# Altium schematic sheet Modules.SchDoc: Modules
size B; DocumentNumber: 13; SheetNumber: 13; SheetTotal: 22
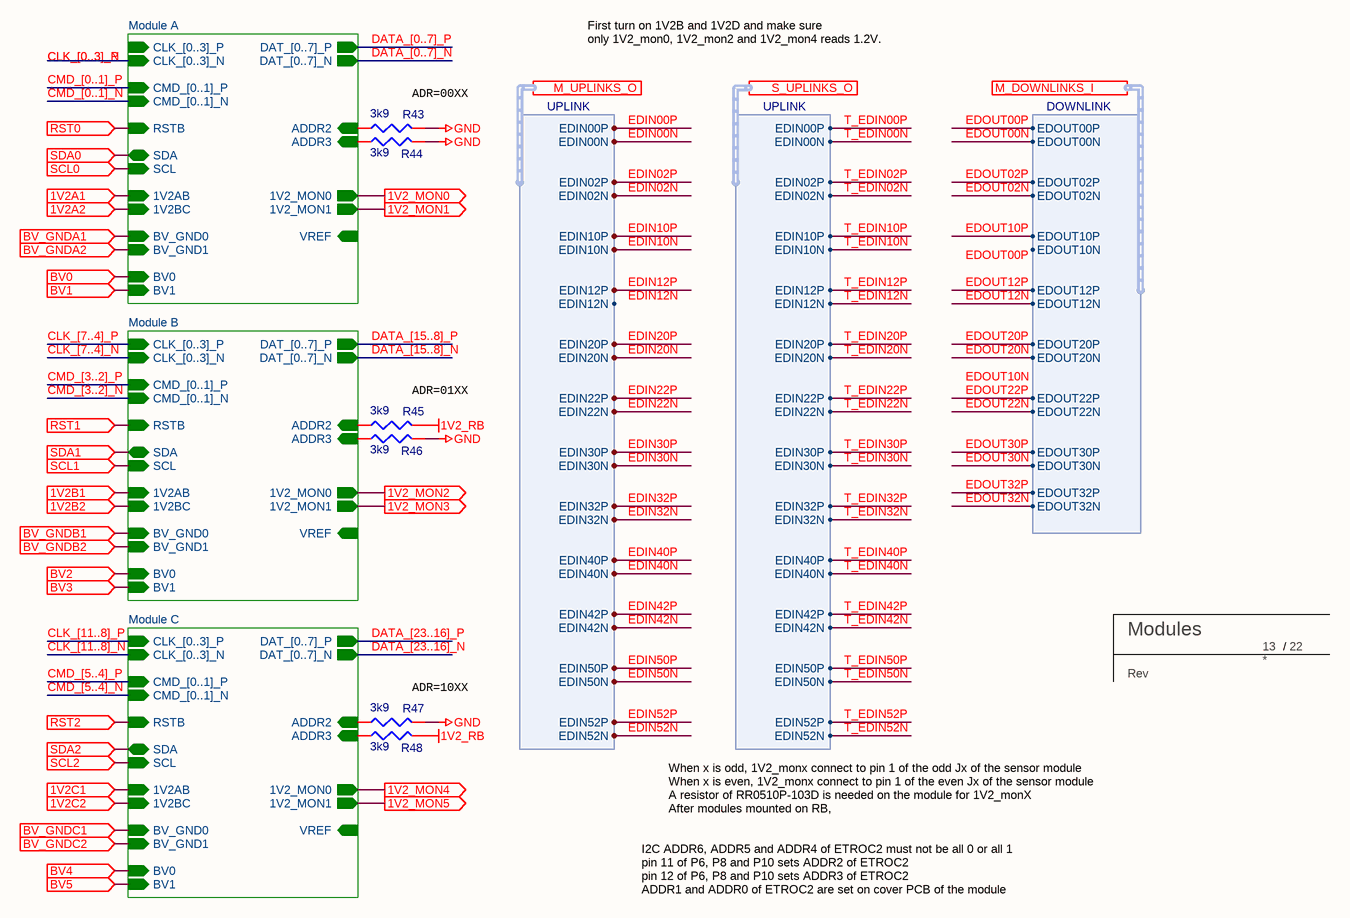
[diagram p0: Modules.SchDoc]

## Parts
R43  3k9  [R_0402_IPC]
R44  3k9  [R_0402_IPC]
R45  3k9  [R_0402_IPC]
R46  3k9  [R_0402_IPC]
R47  3k9  [R_0402_IPC]
R48  3k9  [R_0402_IPC]
TBLOCK?  BU Title block  (value not drawn)  (graphical)

## Sub-sheets
Module A = Module.SchDoc: BV_GND0 (in), VREF (in), 1V2BC (in), 1V2_MON1 (out), 1V2_MON0 (out), RSTB (in), 1V2AB (in), SDA (bidir), SCL (in), DAT_[0..7]_N (out), DAT_[0..7]_P (out), CMD_[0..1]_N (in), CMD_[0..1]_P (in), CLK_[0..3]_N (in), CLK_[0..3]_P (in), BV0 (in), BV1 (in), ADDR3 (in), ADDR2 (in), BV_GND1 (in)
Module B = Module.SchDoc: BV_GND0 (in), VREF (in), 1V2BC (in), 1V2_MON1 (out), 1V2_MON0 (out), RSTB (in), 1V2AB (in), SDA (bidir), SCL (in), DAT_[0..7]_N (out), DAT_[0..7]_P (out), CMD_[0..1]_N (in), CMD_[0..1]_P (in), CLK_[0..3]_N (in), CLK_[0..3]_P (in), BV0 (in), BV1 (in), ADDR3 (in), ADDR2 (in), BV_GND1 (in)
Module C = Module.SchDoc: BV_GND0 (in), VREF (in), 1V2BC (in), 1V2_MON1 (out), 1V2_MON0 (out), RSTB (in), 1V2AB (in), SDA (bidir), SCL (in), DAT_[0..7]_N (out), DAT_[0..7]_P (out), CMD_[0..1]_N (in), CMD_[0..1]_P (in), CLK_[0..3]_N (in), CLK_[0..3]_P (in), BV0 (in), BV1 (in), ADDR2 (in), ADDR3 (in), BV_GND1 (in)

## Ports
1V2_MON0 (out), 1V2_MON1 (out), 1V2_MON2 (out), 1V2_MON3 (out), 1V2_MON4 (out), 1V2_MON5 (out), 1V2A1 (in), 1V2A2 (in), 1V2B1 (in), 1V2B2 (in), 1V2C1 (in), 1V2C2 (in), BV0 (in), BV1 (in), BV2 (in), BV3 (in), BV4 (in), BV5 (in), BV_GNDA1 (in), BV_GNDA2 (in), BV_GNDB1 (in), BV_GNDB2 (in), BV_GNDC1 (in), BV_GNDC2 (in), M_DOWNLINKS_I (harness DOWNLINK), M_UPLINKS_O (harness UPLINK), RST0 (in), RST1 (in), RST2 (in), S_UPLINKS_O (harness UPLINK), SCL0 (in), SCL1 (in), SCL2 (in), SDA0 (in), SDA1 (in), SDA2 (in)

## Harnesses
UPLINK: EDIN00P, EDIN00N, EDIN02P, EDIN02N, EDIN10P, EDIN10N, EDIN12P, EDIN12N, EDIN20P, EDIN20N, EDIN22P, EDIN22N, EDIN30P, EDIN30N, EDIN32P, EDIN32N, EDIN40P, EDIN42P, EDIN50P, EDIN52P, EDIN52N, EDIN50N, EDIN42N, EDIN40N
DOWNLINK: EDOUT30N, EDOUT30P, EDOUT22N, EDOUT22P, EDOUT20N, EDOUT20P, EDOUT12N, EDOUT10N, EDOUT02N, EDOUT00N, EDOUT00P, EDOUT02P, EDOUT10P, EDOUT12P, EDOUT32N, EDOUT32P

## Nets
1V2_RB: R45.2 R48.2
GND: R43.2 R44.2 R46.2 R47.2
1V2_MON0: port 1V2_MON0, sheet Module A/1V2_MON0
1V2_MON1: port 1V2_MON1, sheet Module A/1V2_MON1
1V2_MON2: port 1V2_MON2, sheet Module B/1V2_MON0
1V2_MON3: port 1V2_MON3, sheet Module B/1V2_MON1
1V2_MON4: port 1V2_MON4, sheet Module C/1V2_MON0
1V2_MON5: port 1V2_MON5, sheet Module C/1V2_MON1
1V2A1: port 1V2A1, sheet Module A/1V2AB
1V2A2: port 1V2A2, sheet Module A/1V2BC
1V2B1: port 1V2B1, sheet Module B/1V2AB
1V2B2: port 1V2B2, sheet Module B/1V2BC
1V2C1: port 1V2C1, sheet Module C/1V2AB
1V2C2: port 1V2C2, sheet Module C/1V2BC
BV0: port BV0, sheet Module A/BV0
BV1: port BV1, sheet Module A/BV1
BV2: port BV2, sheet Module B/BV0
BV3: port BV3, sheet Module B/BV1
BV4: port BV4, sheet Module C/BV0
BV5: port BV5, sheet Module C/BV1
BV_GNDA1: port BV_GNDA1, sheet Module A/BV_GND0
BV_GNDA2: port BV_GNDA2, sheet Module A/BV_GND1
BV_GNDB1: port BV_GNDB1, sheet Module B/BV_GND0
BV_GNDB2: port BV_GNDB2, sheet Module B/BV_GND1
BV_GNDC1: port BV_GNDC1, sheet Module C/BV_GND0
BV_GNDC2: port BV_GNDC2, sheet Module C/BV_GND1
EDIN00N: port M_UPLINKS_O.EDIN00N
EDIN00P: port M_UPLINKS_O.EDIN00P
EDIN02N: port M_UPLINKS_O.EDIN02N
EDIN02P: port M_UPLINKS_O.EDIN02P
EDIN10N: port M_UPLINKS_O.EDIN10N
EDIN10P: port M_UPLINKS_O.EDIN10P
EDIN12P: port M_UPLINKS_O.EDIN12P
EDIN20N: port M_UPLINKS_O.EDIN20N
EDIN20P: port M_UPLINKS_O.EDIN20P
EDIN22N: port M_UPLINKS_O.EDIN22N
EDIN22P: port M_UPLINKS_O.EDIN22P
EDIN30N: port M_UPLINKS_O.EDIN30N
EDIN30P: port M_UPLINKS_O.EDIN30P
EDIN32N: port M_UPLINKS_O.EDIN32N
EDIN32P: port M_UPLINKS_O.EDIN32P
EDIN40N: port M_UPLINKS_O.EDIN40N
EDIN40P: port M_UPLINKS_O.EDIN40P
EDIN42N: port M_UPLINKS_O.EDIN42N
EDIN42P: port M_UPLINKS_O.EDIN42P
EDIN50N: port M_UPLINKS_O.EDIN50N
EDIN50P: port M_UPLINKS_O.EDIN50P
EDIN52N: port M_UPLINKS_O.EDIN52N
EDIN52P: port M_UPLINKS_O.EDIN52P
EDOUT00N: port M_DOWNLINKS_I.EDOUT00N
EDOUT00P: port M_DOWNLINKS_I.EDOUT00P
EDOUT02N: port M_DOWNLINKS_I.EDOUT02N
EDOUT02P: port M_DOWNLINKS_I.EDOUT02P
EDOUT10P: port M_DOWNLINKS_I.EDOUT10P
EDOUT12N: port M_DOWNLINKS_I.EDOUT12N
EDOUT12P: port M_DOWNLINKS_I.EDOUT12P
EDOUT20N: port M_DOWNLINKS_I.EDOUT20N
EDOUT20P: port M_DOWNLINKS_I.EDOUT20P
EDOUT22N: port M_DOWNLINKS_I.EDOUT22N
EDOUT22P: port M_DOWNLINKS_I.EDOUT22P
EDOUT30N: port M_DOWNLINKS_I.EDOUT30N
EDOUT30P: port M_DOWNLINKS_I.EDOUT30P
EDOUT32N: port M_DOWNLINKS_I.EDOUT32N
EDOUT32P: port M_DOWNLINKS_I.EDOUT32P
RST0: port RST0, sheet Module A/RSTB
RST1: port RST1, sheet Module B/RSTB
RST2: port RST2, sheet Module C/RSTB
SCL0: port SCL0, sheet Module A/SCL
SCL1: port SCL1, sheet Module B/SCL
SCL2: port SCL2, sheet Module C/SCL
SDA0: port SDA0, sheet Module A/SDA
SDA1: port SDA1, sheet Module B/SDA
SDA2: port SDA2, sheet Module C/SDA
T_EDIN00N: port S_UPLINKS_O.EDIN00N
T_EDIN00P: port S_UPLINKS_O.EDIN00P
T_EDIN02N: port S_UPLINKS_O.EDIN02N
T_EDIN02P: port S_UPLINKS_O.EDIN02P
T_EDIN10N: port S_UPLINKS_O.EDIN10N
T_EDIN10P: port S_UPLINKS_O.EDIN10P
T_EDIN12N: port S_UPLINKS_O.EDIN12N
T_EDIN12P: port S_UPLINKS_O.EDIN12P
T_EDIN20N: port S_UPLINKS_O.EDIN20N
T_EDIN20P: port S_UPLINKS_O.EDIN20P
T_EDIN22N: port S_UPLINKS_O.EDIN22N
T_EDIN22P: port S_UPLINKS_O.EDIN22P
T_EDIN30N: port S_UPLINKS_O.EDIN30N
T_EDIN30P: port S_UPLINKS_O.EDIN30P
T_EDIN32N: port S_UPLINKS_O.EDIN32N
T_EDIN32P: port S_UPLINKS_O.EDIN32P
T_EDIN40N: port S_UPLINKS_O.EDIN40N
T_EDIN40P: port S_UPLINKS_O.EDIN40P
T_EDIN42N: port S_UPLINKS_O.EDIN42N
T_EDIN42P: port S_UPLINKS_O.EDIN42P
T_EDIN50N: port S_UPLINKS_O.EDIN50N
T_EDIN50P: port S_UPLINKS_O.EDIN50P
T_EDIN52N: port S_UPLINKS_O.EDIN52N
T_EDIN52P: port S_UPLINKS_O.EDIN52P
NetR43_1: R43.1 ; sheet Module A/ADDR2
NetR44_1: R44.1 ; sheet Module A/ADDR3
NetR45_1: R45.1 ; sheet Module B/ADDR2
NetR46_1: R46.1 ; sheet Module B/ADDR3
NetR47_1: R47.1 ; sheet Module C/ADDR2
NetR48_1: R48.1 ; sheet Module C/ADDR3

## Buses and harness runs
bus CLK_[0..3]_N = CLK_[0..3]_P
bus CLK_[7..4]_N = sheet Module B/CLK_[0..3]_N
bus CLK_[7..4]_P = sheet Module B/CLK_[0..3]_P
bus CLK_[11..8]_N = sheet Module C/CLK_[0..3]_N
bus CLK_[11..8]_P = sheet Module C/CLK_[0..3]_P
bus CMD_[0..1]_N = sheet Module A/CMD_[0..1]_N
bus CMD_[0..1]_P = sheet Module A/CMD_[0..1]_P
bus CMD_[3..2]_N = sheet Module B/CMD_[0..1]_N
bus CMD_[3..2]_P = sheet Module B/CMD_[0..1]_P
bus CMD_[5..4]_N = sheet Module C/CMD_[0..1]_N
bus CMD_[5..4]_P = sheet Module C/CMD_[0..1]_P
bus DATA_[0..7]_N = sheet Module A/DAT_[0..7]_N
bus DATA_[0..7]_P = sheet Module A/DAT_[0..7]_P
bus DATA_[15..8]_N = sheet Module B/DAT_[0..7]_N
bus DATA_[15..8]_P = sheet Module B/DAT_[0..7]_P
bus DATA_[23..16]_N = sheet Module C/DAT_[0..7]_N
bus DATA_[23..16]_P = sheet Module C/DAT_[0..7]_P

## Notes on the sheet
- First turn on 1V2B and 1V2D and make sure
- only 1V2_mon0, 1V2_mon2 and 1V2_mon4 reads 1.2V.
- ADR=00XX
- ADR=01XX
- ADR=10XX
- A resistor of RR0510P-103D is needed on the module for 1V2_monX
- After modules mounted on RB,
- When x is odd, 1V2_monx connect to pin 1 of the odd Jx of the sensor module
- When x is even, 1V2_monx connect to pin 1 of the even Jx of the sensor module
- I2C ADDR6, ADDR5 and ADDR4 of ETROC2 must not be all 0 or all 1
- pin 11 of P6, P8 and P10 sets ADDR2 of ETROC2
- pin 12 of P6, P8 and P10 sets ADDR3 of ETROC2
- ADDR1 and ADDR0 of ETROC2 are set on cover PCB of the module
- Labels drawn without touching a wire or pin: EDIN12N, EDOUT00P, EDOUT10N
- (in symbol TITLE_BLOCK_BU) /; Rev

## Library data of the parts
R43-R48 = R-E3-3K9-0402-5%: RES SMD 3.9K OHM 5% 1/16W 0402
TBLOCK? = TITLE_BLOCK_BU